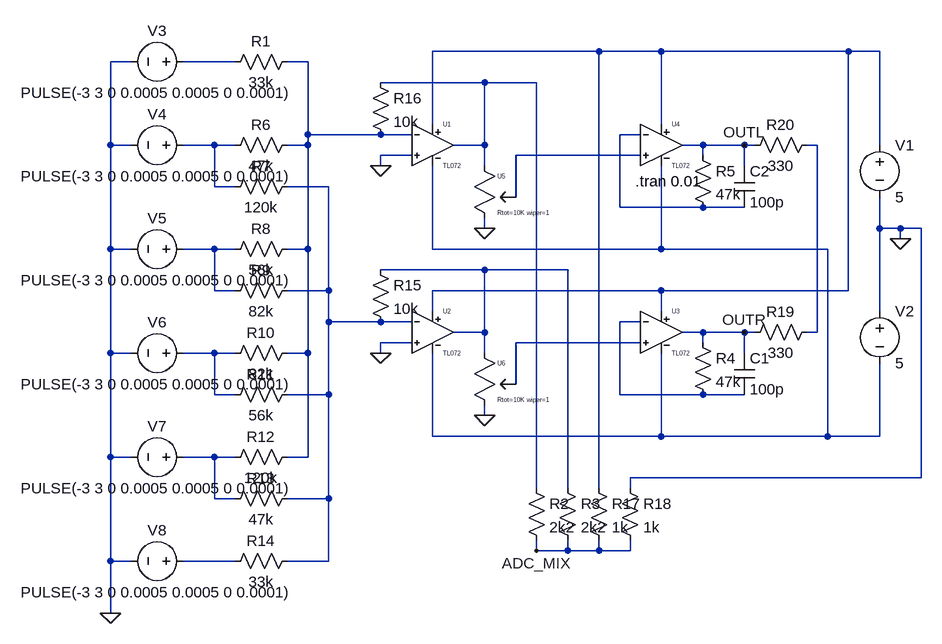
[diagram p0: schematic out.asc]
out.asc, the LTspice schematic file:
Version 4
SHEET 1 880 884
WIRE 224 0 -32 0
WIRE 320 0 224 0
WIRE 608 0 320 0
WIRE 656 0 608 0
WIRE -496 16 -528 16
WIRE -336 16 -416 16
WIRE -224 16 -256 16
WIRE 48 48 -112 48
WIRE 128 48 48 48
WIRE -32 112 -32 0
WIRE 320 112 320 0
WIRE -224 128 -224 16
WIRE -112 128 -224 128
WIRE -64 128 -112 128
WIRE 288 128 256 128
WIRE -528 144 -528 16
WIRE -496 144 -528 144
WIRE -368 144 -416 144
WIRE -336 144 -368 144
WIRE -224 144 -224 128
WIRE -224 144 -256 144
WIRE 48 144 48 48
WIRE 48 144 0 144
WIRE 384 144 352 144
WIRE 448 144 384 144
WIRE 464 144 448 144
WIRE 560 144 544 144
WIRE 656 144 656 0
WIRE -64 160 -112 160
WIRE 288 160 96 160
WIRE 384 160 384 144
WIRE -112 176 -112 160
WIRE 48 176 48 144
WIRE 448 176 448 144
WIRE -368 208 -368 144
WIRE -336 208 -368 208
WIRE -192 208 -256 208
WIRE 96 224 96 160
WIRE 256 240 256 128
WIRE 384 240 256 240
WIRE 448 240 384 240
WIRE 48 272 48 256
WIRE 656 272 656 224
WIRE 688 272 656 272
WIRE 720 272 688 272
WIRE 688 288 688 272
WIRE -528 304 -528 144
WIRE -496 304 -528 304
WIRE -368 304 -416 304
WIRE -336 304 -368 304
WIRE -224 304 -224 144
WIRE -224 304 -256 304
WIRE -32 304 -32 176
WIRE 320 304 320 176
WIRE 320 304 -32 304
WIRE 576 304 320 304
WIRE 48 336 -112 336
WIRE 176 336 48 336
WIRE -368 368 -368 304
WIRE -336 368 -368 368
WIRE -192 368 -192 208
WIRE -192 368 -256 368
WIRE 320 368 -32 368
WIRE 608 368 608 0
WIRE 608 368 320 368
WIRE -32 400 -32 368
WIRE 320 400 320 368
WIRE 656 400 656 272
WIRE -192 416 -192 368
WIRE -112 416 -192 416
WIRE -64 416 -112 416
WIRE 288 416 256 416
WIRE 48 432 48 336
WIRE 48 432 0 432
WIRE 384 432 352 432
WIRE 448 432 384 432
WIRE 464 432 448 432
WIRE 560 432 560 144
WIRE 560 432 544 432
WIRE -64 448 -112 448
WIRE 288 448 96 448
WIRE 384 448 384 432
WIRE -528 464 -528 304
WIRE -496 464 -528 464
WIRE -368 464 -416 464
WIRE -336 464 -368 464
WIRE -224 464 -224 304
WIRE -224 464 -256 464
WIRE -112 464 -112 448
WIRE 48 464 48 432
WIRE 448 464 448 432
WIRE 96 512 96 448
WIRE -368 528 -368 464
WIRE -336 528 -368 528
WIRE -192 528 -192 416
WIRE -192 528 -256 528
WIRE 256 528 256 416
WIRE 384 528 256 528
WIRE 448 528 384 528
WIRE 48 560 48 544
WIRE -32 592 -32 464
WIRE 320 592 320 464
WIRE 320 592 -32 592
WIRE 576 592 576 304
WIRE 576 592 320 592
WIRE 656 592 656 480
WIRE 656 592 576 592
WIRE -528 624 -528 464
WIRE -496 624 -528 624
WIRE -368 624 -416 624
WIRE -336 624 -368 624
WIRE -224 624 -224 464
WIRE -224 624 -256 624
WIRE 720 656 720 272
WIRE 720 656 272 656
WIRE 128 672 128 48
WIRE 176 672 176 336
WIRE 224 672 224 0
WIRE 272 672 272 656
WIRE -368 688 -368 624
WIRE -336 688 -368 688
WIRE -192 688 -192 528
WIRE -192 688 -256 688
WIRE 128 768 128 752
WIRE 176 768 176 752
WIRE 176 768 128 768
WIRE 224 768 224 752
WIRE 224 768 176 768
WIRE 272 768 272 752
WIRE 272 768 224 768
WIRE -528 784 -528 624
WIRE -496 784 -528 784
WIRE -336 784 -416 784
WIRE -192 784 -192 688
WIRE -192 784 -256 784
WIRE -528 864 -528 784
FLAG 688 288 0
FLAG 48 272 0
FLAG 48 560 0
FLAG 448 144 OUTL
FLAG 448 432 OUTR
FLAG -528 864 0
FLAG -112 176 0
FLAG -112 464 0
FLAG 128 768 ADC_MIX
SYMBOL res 368 432 R0
SYMATTR InstName R4
SYMATTR Value 47k
SYMBOL res 368 144 R0
SYMATTR InstName R5
SYMATTR Value 47k
SYMBOL cap 432 464 R0
SYMATTR InstName C1
SYMATTR Value 100p
SYMBOL cap 432 176 R0
SYMATTR InstName C2
SYMATTR Value 100p
SYMBOL voltage 656 128 R0
WINDOW 123 0 0 Left 2
WINDOW 39 0 0 Left 2
SYMATTR InstName V1
SYMATTR Value 5
SYMBOL voltage 656 384 R0
WINDOW 123 0 0 Left 2
WINDOW 39 0 0 Left 2
SYMATTR InstName V2
SYMATTR Value 5
SYMBOL potentiometer 32 160 R0
SYMATTR InstName U5
SYMATTR Value Rtot=10K wiper=1
SYMBOL potentiometer 32 448 R0
SYMATTR InstName U6
SYMATTR Value Rtot=10K wiper=1
SYMBOL res -240 0 R90
WINDOW 0 0 56 VBottom 2
WINDOW 3 32 56 VTop 2
SYMATTR InstName R1
SYMATTR Value 33k
SYMBOL res -240 128 R90
WINDOW 0 0 56 VBottom 2
WINDOW 3 32 56 VTop 2
SYMATTR InstName R6
SYMATTR Value 47k
SYMBOL res -240 192 R90
WINDOW 0 0 56 VBottom 2
WINDOW 3 32 56 VTop 2
SYMATTR InstName R7
SYMATTR Value 120k
SYMBOL res -240 288 R90
WINDOW 0 0 56 VBottom 2
WINDOW 3 32 56 VTop 2
SYMATTR InstName R8
SYMATTR Value 56k
SYMBOL res -240 352 R90
WINDOW 0 0 56 VBottom 2
WINDOW 3 32 56 VTop 2
SYMATTR InstName R9
SYMATTR Value 82k
SYMBOL res -240 448 R90
WINDOW 0 0 56 VBottom 2
WINDOW 3 32 56 VTop 2
SYMATTR InstName R10
SYMATTR Value 82k
SYMBOL res -240 512 R90
WINDOW 0 0 56 VBottom 2
WINDOW 3 32 56 VTop 2
SYMATTR InstName R11
SYMATTR Value 56k
SYMBOL res -240 608 R90
WINDOW 0 0 56 VBottom 2
WINDOW 3 32 56 VTop 2
SYMATTR InstName R12
SYMATTR Value 120k
SYMBOL res -240 672 R90
WINDOW 0 0 56 VBottom 2
WINDOW 3 32 56 VTop 2
SYMATTR InstName R13
SYMATTR Value 47k
SYMBOL res -240 768 R90
WINDOW 0 0 56 VBottom 2
WINDOW 3 32 56 VTop 2
SYMATTR InstName R14
SYMATTR Value 33k
SYMBOL res -128 320 R0
SYMATTR InstName R15
SYMATTR Value 10k
SYMBOL res -128 32 R0
SYMATTR InstName R16
SYMATTR Value 10k
SYMBOL voltage -400 16 R90
WINDOW 0 -32 56 VBottom 2
WINDOW 3 32 56 VTop 2
WINDOW 123 0 0 Left 2
WINDOW 39 0 0 Left 2
SYMATTR InstName V3
SYMATTR Value PULSE(-3 3 0 0.0005 0.0005 0 0.0001)
SYMBOL voltage -400 144 R90
WINDOW 0 -32 56 VBottom 2
WINDOW 3 32 56 VTop 2
WINDOW 123 0 0 Left 2
WINDOW 39 0 0 Left 2
SYMATTR InstName V4
SYMATTR Value PULSE(-3 3 0 0.0005 0.0005 0 0.0001)
SYMBOL voltage -400 304 R90
WINDOW 0 -32 56 VBottom 2
WINDOW 3 32 56 VTop 2
WINDOW 123 0 0 Left 2
WINDOW 39 0 0 Left 2
SYMATTR InstName V5
SYMATTR Value PULSE(-3 3 0 0.0005 0.0005 0 0.0001)
SYMBOL voltage -400 464 R90
WINDOW 0 -32 56 VBottom 2
WINDOW 3 32 56 VTop 2
WINDOW 123 0 0 Left 2
WINDOW 39 0 0 Left 2
SYMATTR InstName V6
SYMATTR Value PULSE(-3 3 0 0.0005 0.0005 0 0.0001)
SYMBOL voltage -400 624 R90
WINDOW 0 -32 56 VBottom 2
WINDOW 3 32 56 VTop 2
WINDOW 123 0 0 Left 2
WINDOW 39 0 0 Left 2
SYMATTR InstName V7
SYMATTR Value PULSE(-3 3 0 0.0005 0.0005 0 0.0001)
SYMBOL voltage -400 784 R90
WINDOW 0 -32 56 VBottom 2
WINDOW 3 32 56 VTop 2
WINDOW 123 0 0 Left 2
WINDOW 39 0 0 Left 2
SYMATTR InstName V8
SYMATTR Value PULSE(-3 3 0 0.0005 0.0005 0 0.0001)
SYMBOL TL072 -32 80 R0
SYMATTR InstName U1
SYMBOL TL072 -32 368 R0
SYMATTR InstName U2
SYMBOL TL072 320 368 R0
SYMATTR InstName U3
SYMBOL TL072 320 80 R0
SYMATTR InstName U4
SYMBOL res 112 656 R0
SYMATTR InstName R2
SYMATTR Value 2k2
SYMBOL res 160 656 R0
SYMATTR InstName R3
SYMATTR Value 2k2
SYMBOL res 208 656 R0
SYMATTR InstName R17
SYMATTR Value 1k
SYMBOL res 256 656 R0
SYMATTR InstName R18
SYMATTR Value 1k
SYMBOL res 560 416 R90
WINDOW 0 0 56 VBottom 2
WINDOW 3 32 56 VTop 2
SYMATTR InstName R19
SYMATTR Value 330
SYMBOL res 560 128 R90
WINDOW 0 0 56 VBottom 2
WINDOW 3 32 56 VTop 2
SYMATTR InstName R20
SYMATTR Value 330
TEXT 280 200 Left 2 !.tran 0.01

The netlist it stands for:
* out.asc
R4 OUTR N013 47k
R5 OUTL N005 47k
C1 OUTR N013 100p
C2 OUTL N005 100p
V1 N001 0 5
V2 0 N011 5
XU5 N004 0 N008 potentiometer Rtot=10K wiper=1  ; pins A B C
XU6 N012 0 N014 potentiometer Rtot=10K wiper=1  ; pins A B C
R1 N003 N002 33k
R6 N003 N006 47k
R7 N009 N006 120k
R8 N003 N010 56k
R9 N009 N010 82k
R10 N003 N015 82k
R11 N009 N015 56k
R12 N003 N016 120k
R13 N009 N016 47k
R14 N009 N017 33k
R15 N012 N009 10k
R16 N004 N003 10k
V3 N002 0 PULSE(-3 3 0 0.0005 0.0005 0 0.0001)
V4 N006 0 PULSE(-3 3 0 0.0005 0.0005 0 0.0001)
V5 N010 0 PULSE(-3 3 0 0.0005 0.0005 0 0.0001)
V6 N015 0 PULSE(-3 3 0 0.0005 0.0005 0 0.0001)
V7 N016 0 PULSE(-3 3 0 0.0005 0.0005 0 0.0001)
V8 N017 0 PULSE(-3 3 0 0.0005 0.0005 0 0.0001)
XU1 0 N003 N001 N011 N004 TL072 TL072  ; pins In+ In- V+ V- OUT
XU2 0 N009 N001 N011 N012 TL072 TL072  ; pins In+ In- V+ V- OUT
XU3 N014 N013 N001 N011 OUTR TL072 TL072  ; pins In+ In- V+ V- OUT
XU4 N008 N005 N001 N011 OUTL TL072 TL072  ; pins In+ In- V+ V- OUT
R2 N004 ADC_MIX 2k2
R3 N012 ADC_MIX 2k2
R17 N001 ADC_MIX 1k
R18 0 ADC_MIX 1k
R19 N007 OUTR 330
R20 N007 OUTL 330
.tran 0.01
.lib potentiometer.sub
.lib TL072.sub
.backanno
.end